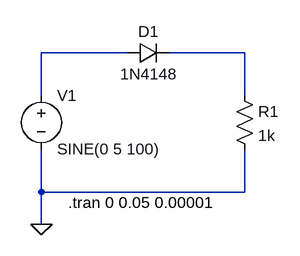
[diagram p0: schematic Problem02 (2).asc]
Problem02 (2).asc, the LTspice schematic file:
Version 4
SHEET 1 880 680
WIRE 160 32 32 32
WIRE 336 32 224 32
WIRE 32 96 32 32
WIRE 336 96 336 32
WIRE 32 240 32 176
WIRE 336 240 336 176
WIRE 336 240 32 240
WIRE 32 288 32 240
FLAG 32 288 0
SYMBOL voltage 32 80 R0
WINDOW 123 0 0 Left 0
WINDOW 39 0 0 Left 0
SYMATTR InstName V1
SYMATTR Value SINE(0 5 100)
SYMBOL res 320 80 R0
SYMATTR InstName R1
SYMATTR Value 1k
SYMBOL diode 160 48 R270
WINDOW 0 32 32 VTop 2
WINDOW 3 0 32 VBottom 2
SYMATTR InstName D1
SYMATTR Value 1N4148
TEXT 72 256 Left 2 !.tran 0 0.05 0.00001

The netlist it stands for:
* Problem02 (2).asc
V1 N001 0 SINE(0 5 100)
R1 N002 0 1k
D1 N001 N002 1N4148
.model D D
.lib standard.dio
.tran 0 0.05 0.00001
.backanno
.end